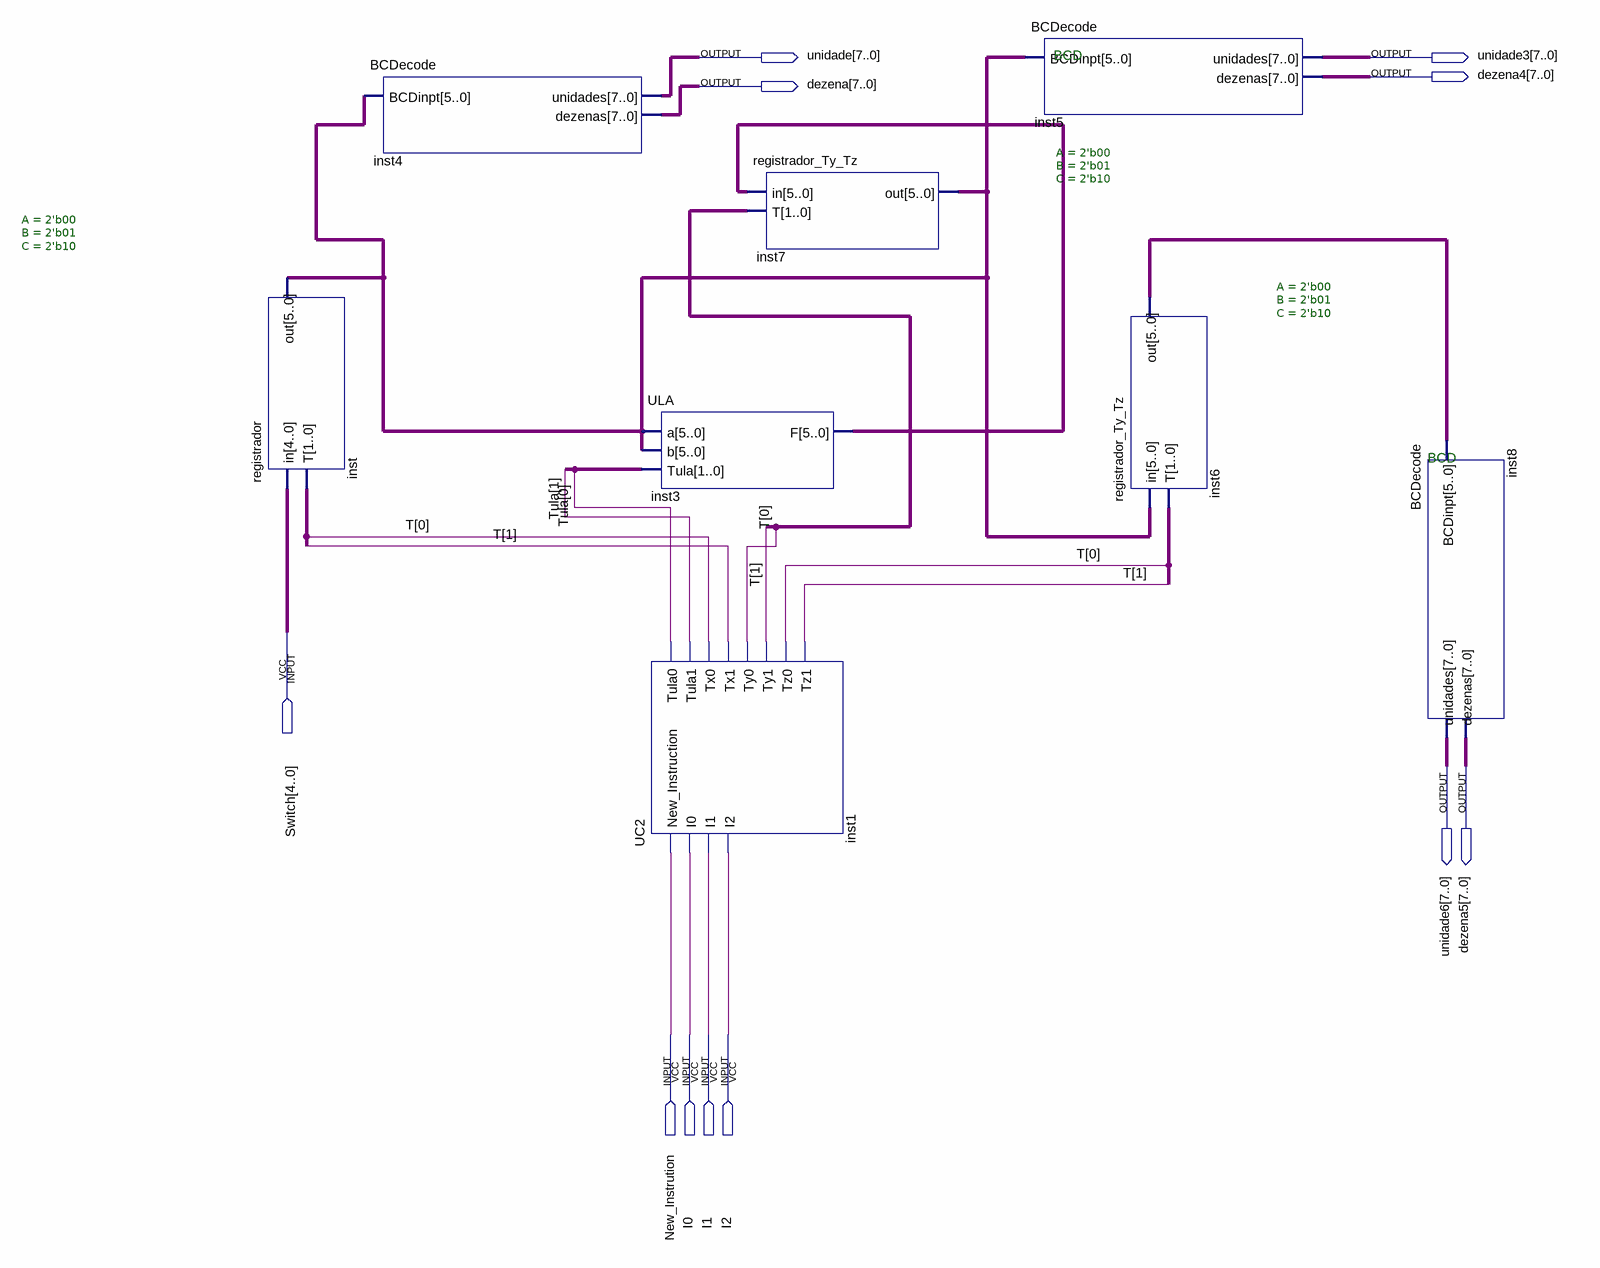
[diagram p0: schematic sheet]
// Quartus schematic aidento.bdf as structural Verilog: 8 symbols, 11 pins
module aidento (
  input  [4:0] Switch,
  input  New_Instrution,
  input  I0,
  input  I1,
  input  I2,
  output [7:0] unidade,
  output [7:0] unidade3,
  output [7:0] dezena4,
  output [7:0] dezena,
  output [7:0] unidade6,
  output [7:0] dezena5
);

  wire [1:0] T, Tula, undriven, undriven_2, undriven_3, undriven_4;
  wire [5:0] inst3_f, inst6_out, inst_out;

  registrador #(.A(2'b00), .B(2'b01), .C(2'b10)) inst (.in(Switch), .T(undriven_4), .out(inst_out));
  BCDecode inst4 (.BCDinpt(inst_out), .unidades(unidade), .dezenas(dezena));
  ULA inst3 (.a(inst_out), .b(inst_out), .Tula(undriven_3), .F(inst3_f));
  UC2 inst1 (
    .New_Instruction(New_Instrution), .I0(I0), .I1(I1), .I2(I2), .Tula0(Tula[0]), .Tula1(Tula[1]),
    .Tx0(T[0]), .Tx1(T[1]), .Ty0(T[0]), .Ty1(T[1]), .Tz0(T[0]), .Tz1(T[1]));
  registrador_Ty_Tz #(.A(2'b00), .B(2'b01), .C(2'b10)) inst7 (.in(inst3_f), .T(undriven_2), .out(inst_out));
  BCDecode inst5 (.BCDinpt(inst_out), .unidades(unidade3), .dezenas(dezena4));
  registrador_Ty_Tz #(.A(2'b00), .B(2'b01), .C(2'b10)) inst6 (.in(inst_out), .T(undriven), .out(inst6_out));
  BCDecode inst8 (.BCDinpt(inst6_out), .unidades(unidade6), .dezenas(dezena5));

  // Notes on the sheet:
  //   BCD
  //   BCD
endmodule
